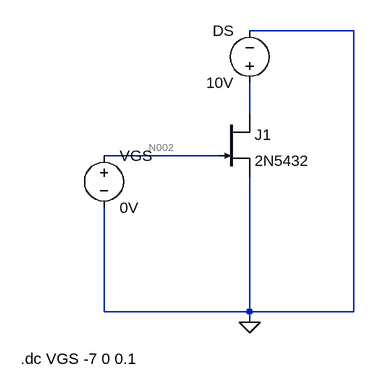
[diagram p0: schematic TECJ_caracteristica de transfer.asc]
TECJ_caracteristica de transfer.asc, the LTspice schematic file:
Version 4.1
SHEET 1 880 680
WIRE 384 -160 224 -160
WIRE 224 -32 224 -80
WIRE 176 32 0 32
WIRE 0 272 0 112
WIRE 224 272 224 64
WIRE 224 272 0 272
WIRE 384 272 384 -160
WIRE 384 272 224 272
WIRE 224 288 224 272
FLAG 224 288 0
SYMBOL njf 176 -32 R0
SYMATTR InstName J1
SYMATTR Value 2N5432
SYMBOL voltage 224 -64 R180
WINDOW 0 24 96 Left 2
WINDOW 3 24 16 Left 2
SYMATTR InstName DS
SYMATTR Value 10V
SYMBOL voltage 0 16 R0
SYMATTR InstName VGS
SYMATTR Value 0V
TEXT -128 344 Left 2 !.dc VGS -7 0 0.1

The netlist it stands for:
* TECJ_caracteristica de transfer.asc
J1 N001 N002 0 2N5432
V§DS N001 0 10V
VGS N002 0 0V
.model NJF NJF
.model PJF PJF
.lib standard.jft
.dc VGS -7 0 0.1
.backanno
.end

* Results of the author's LTspice run, read from the files saved beside the schematic
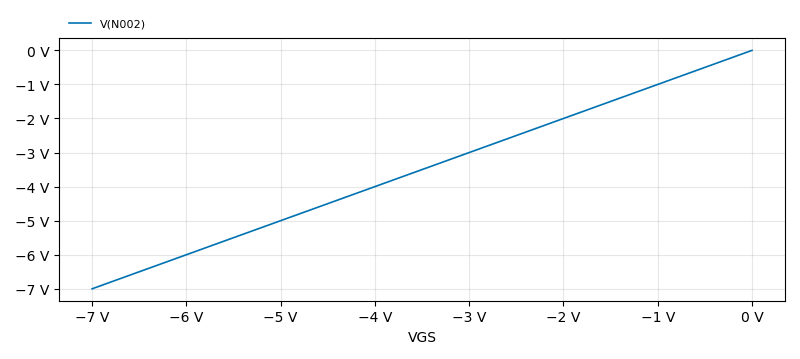
[diagram p1: DC transfer characteristic of TECJ_caracteristica de transfer.asc, plotted from the saved traces]
* DC transfer characteristic, 1 run:
*   V(N002): -7 V at VGS=-7 V, 0 V at VGS=0 V, min -7 V, max 0 V